# EAGLE design PWM_Input_Filter (EAGLE 7.3.0)
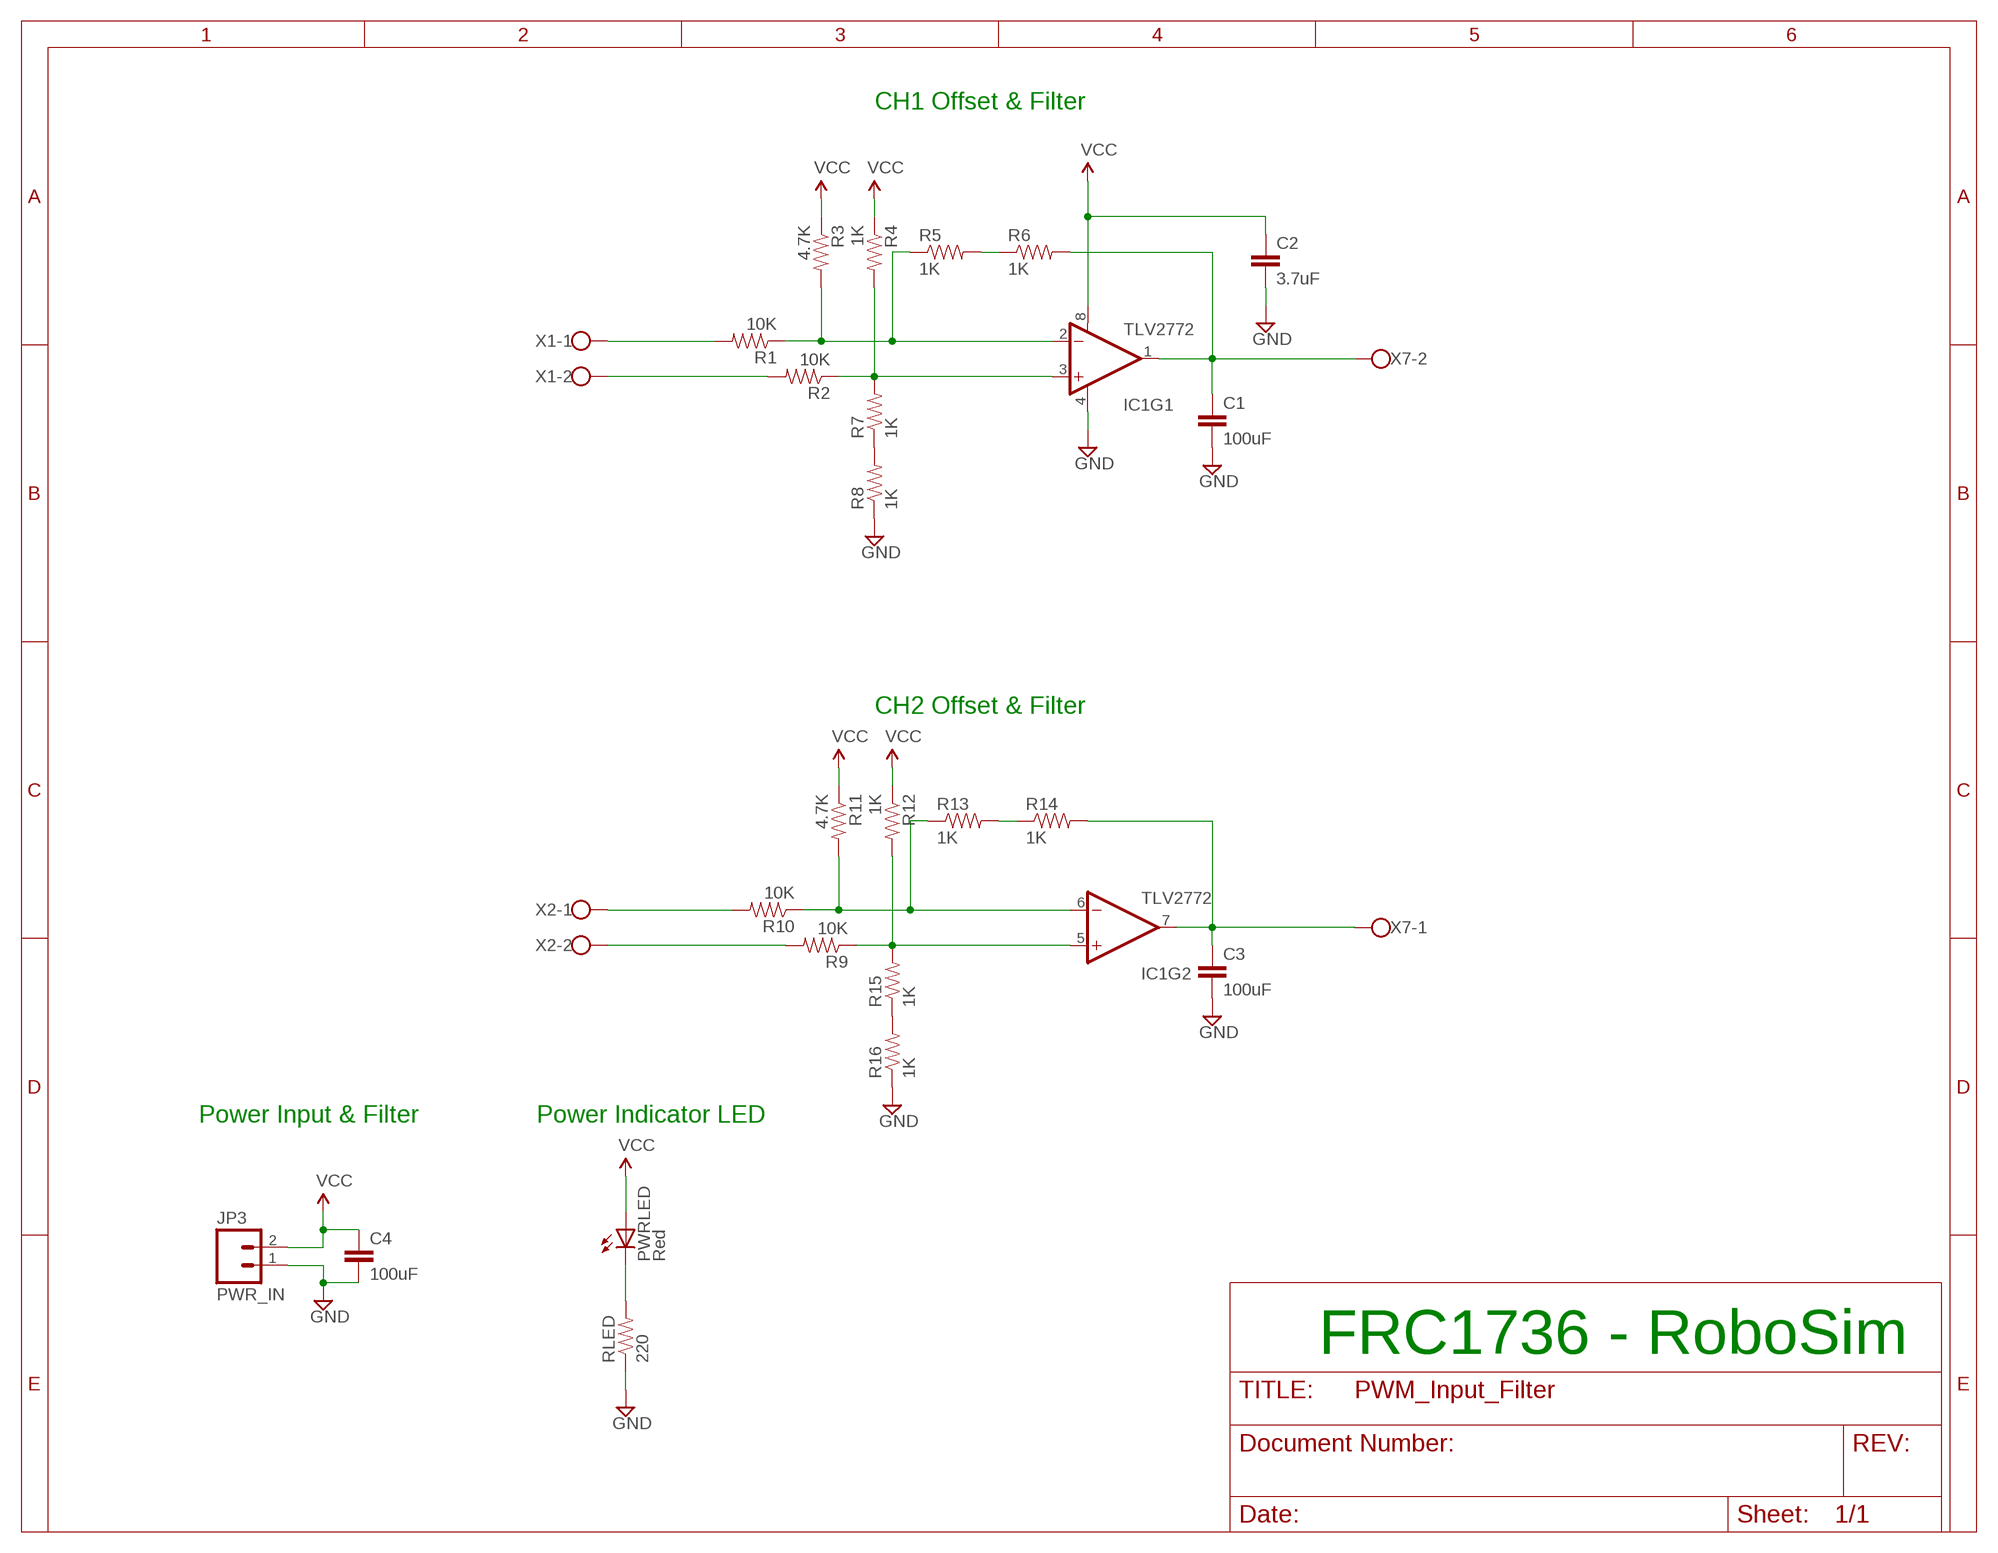
[diagram p0: schematic, sheet 1]

## Parts
C1  100uF  CAPPTH  [CAP-PTH-SMALL]
C2  3.7uF  CAPPTH  [CAP-PTH-SMALL]
C3  100uF  CAPPTH  [CAP-PTH-SMALL]
C4  100uF  CAPPTH  [CAP-PTH-SMALL]
IC1  TLV2772  LM358  [DIP08]
JP3  PWR_IN  M02LOCK  [1X02_LOCK]
PWRLED  Red  LED5MM  [LED5MM]
R1  10K  RESISTORAXIAL-0.3  [AXIAL-0.3]
R2  10K  RESISTORAXIAL-0.3  [AXIAL-0.3]
R3  4.7K  RESISTORAXIAL-0.3  [AXIAL-0.3]
R4  1K  RESISTORAXIAL-0.3  [AXIAL-0.3]
R5  1K  RESISTORAXIAL-0.3  [AXIAL-0.3]
R6  1K  RESISTORAXIAL-0.3  [AXIAL-0.3]
R7  1K  RESISTORAXIAL-0.3  [AXIAL-0.3]
R8  1K  RESISTORAXIAL-0.3  [AXIAL-0.3]
R9  10K  RESISTORAXIAL-0.3  [AXIAL-0.3]
R10  10K  RESISTORAXIAL-0.3  [AXIAL-0.3]
R11  4.7K  RESISTORAXIAL-0.3  [AXIAL-0.3]
R12  1K  RESISTORAXIAL-0.3  [AXIAL-0.3]
R13  1K  RESISTORAXIAL-0.3  [AXIAL-0.3]
R14  1K  RESISTORAXIAL-0.3  [AXIAL-0.3]
R15  1K  RESISTORAXIAL-0.3  [AXIAL-0.3]
R16  1K  RESISTORAXIAL-0.3  [AXIAL-0.3]
RLED  220  RESISTORAXIAL-0.3  [AXIAL-0.3]
X1  W237-102  [W237-102]
X2  W237-102  [W237-102]
X7  W237-102  [W237-102]

## Nets
GND: C1.2 C2.2 C3.2 C4.2 IC1.4(V-) JP3.1 R8.P$1 R16.P$1 RLED.P$1
N$1: R1.P$2 X1.1
N$3: R9.P$2 X2.2
N$5: PWRLED.K(C) RLED.P$2
N$6: IC1.2(-IN) R1.P$1 R3.P$2 R5.P$1
N$7: IC1.3(+IN) R2.P$1 R4.P$2 R7.P$2
N$8: R2.P$2 X1.2
N$9: R5.P$2 R6.P$1
N$10: R7.P$1 R8.P$2
N$11: IC1.6(-IN) R10.P$1 R11.P$2 R13.P$1
N$12: IC1.5(+IN) R9.P$1 R12.P$2 R15.P$2
N$13: C3.1 IC1.7(OUT) R14.P$2 X7.1
N$14: R10.P$2 X2.1
N$15: R13.P$2 R14.P$1
N$17: R15.P$1 R16.P$2
N$44: C1.1 IC1.1(OUT) R6.P$2 X7.2
VCC: C2.1 C4.1 IC1.8(V+) JP3.2 PWRLED.A R3.P$1 R4.P$1 R11.P$1 R12.P$1

## Notes on the sheet
- CH1 Offset & Filter
- CH2 Offset & Filter
- Power Input & Filter | Power Indicator LED
- FRC1736 - RoboSim

## Library data of the parts
C1-C4 = SparkFun-Passives:CAP: Capacitor Standard 0603 ceramic capacitor, and 0.1" leaded capacitor.
IC1 = SparkFun-AnalogIC:LM358: Jellybean op-amp; PROD_ID: IC-09172
JP3 = SparkFun-Connectors:M02: Standard 2-pin 0.1" header. Use with - straight break away headers ( PRT-00116) - right angle break away headers (PRT-00553) - swiss pins (PRT-00743) - machine pins (PRT-00117) - female headers (PRT-00115) Molex polarized connector foot print use with: PRT-08233 with associated crimp pins and housings. 2.54_SCREWTERM for use with PRT-10571. 3.5mm Screw Terminal footprints for PRT-08084 5mm Screw Terminal footprints for use with PRT-08433
PWRLED = SparkFun-LED:LED: LEDs Standard schematic elements and footprints for 5mm, 3mm, 1206, and 0603 sized LEDs. 5mm - Spark Fun Electronics SKU : COM-00529 (and others)
R1-R16 RLED = SparkFun-Passives:RESISTOR: Resistor Basic schematic elements and footprints for 0603, 1206, and PTH resistors.
X1 X2 X7 = con-wago-500:W237-102: WAGO SCREW CLAMP; MPN: 237-102; OC_FARNELL: unknown; OC_NEWARK: 70K9898

## Board
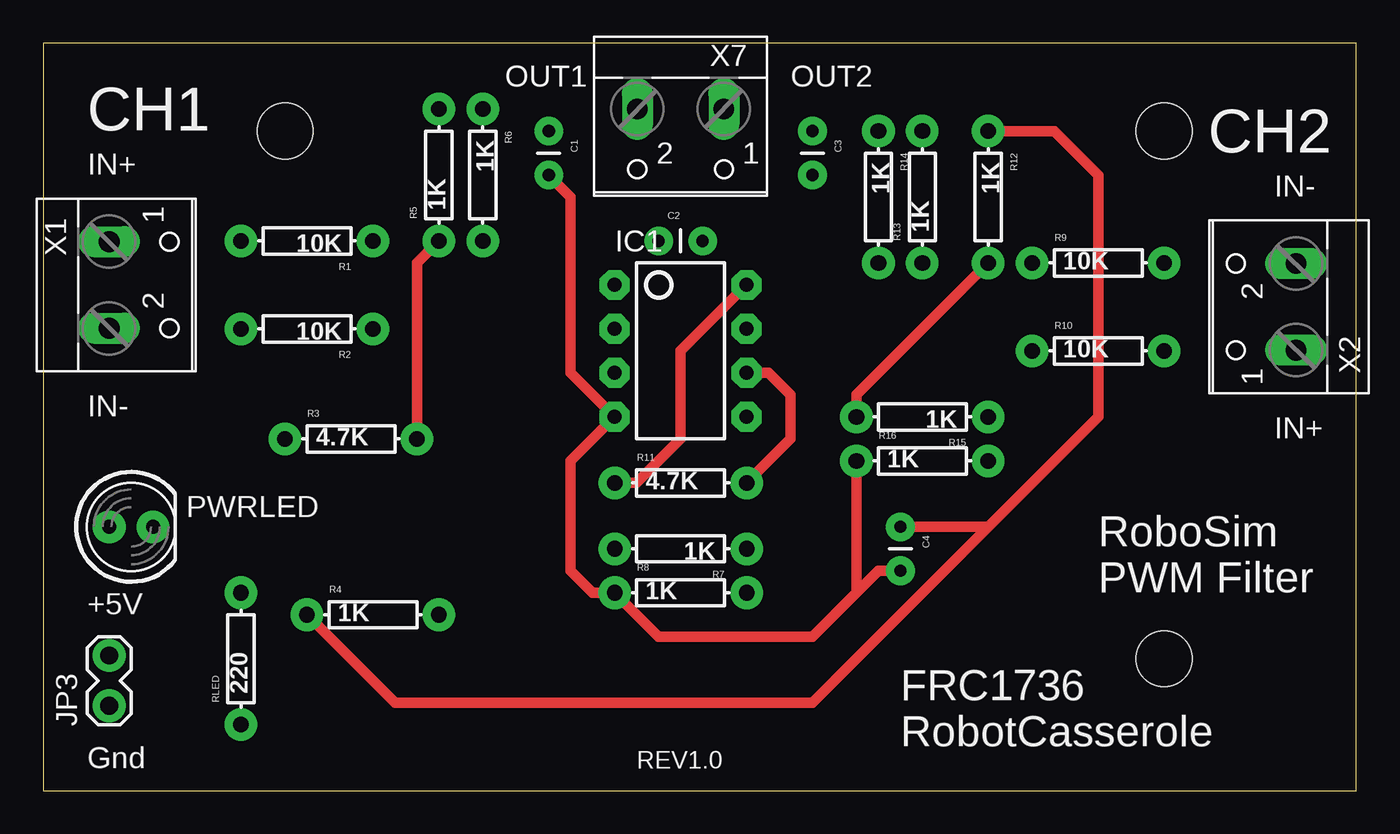
[diagram p1: board, top side]
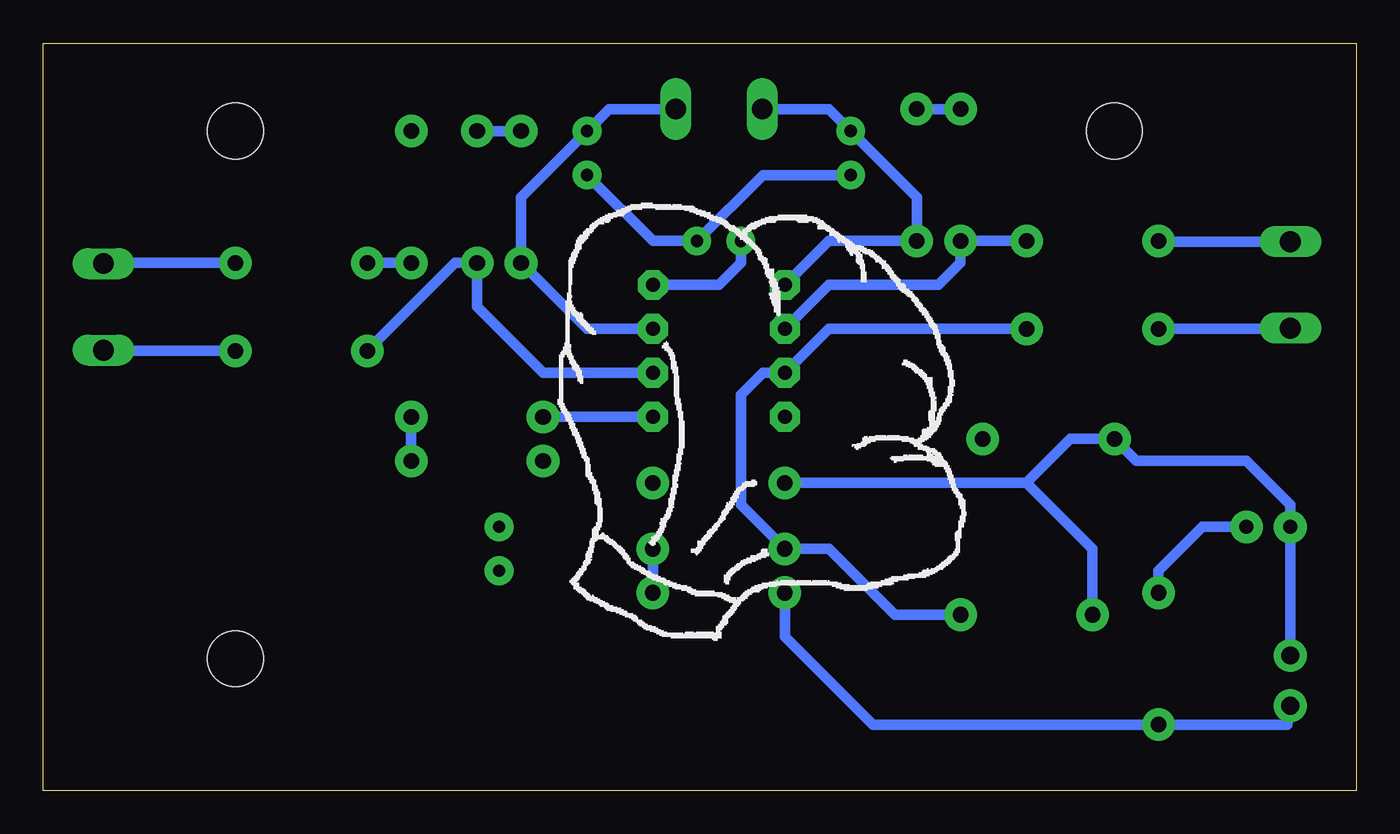
[diagram p2: board, bottom side, seen from below]

Size 75.87 x 43.17 mm. Coordinates in mm from the lower left corner, seen from the top.
Outline: 0,0 75.87,0 75.87,43.17 0,43.17 0,0
Copper layers (1*16): Top 0.0356mm / dielectric 1.5011mm / Bottom 0.0356mm
Design rules "LaenPCBOrder": minimum track width 6mil, minimum drill 13mil, track to track 6mil, track to pad 6mil, pad to pad 6mil, via to via 6mil, smd to smd 6mil, copper to edge 15mil, drill to drill 6mil, minimum pad ring 7mil, minimum via ring 7mil, stop-mask expansion 3mil, vias tented up to drill 0mil, thermal gap 10mil
Holes 3.2 mm at 13.97,38.1 64.77,38.1 64.77,7.62

### Footprints (pad centres in the part's own frame; a part is rotated, then mirrored left to right if it is on the bottom)
CAP-PTH-SMALL = drill 0.7 pad 1.651: 1 0,0; 2 2.54,0
DIP08 = drill 0.813 pad 1.727 octagon: 1 -3.81,-3.81; 2 -1.27,-3.81; 3 1.27,-3.81; 4 3.81,-3.81; 5 3.81,3.81; 6 1.27,3.81; 7 -1.27,3.81; 8 -3.81,3.81
1X02_LOCK = drill 1.016 pad 1.88: 1 -0.178,0; 2 2.718,0
LED5MM = drill 0.813 pad 1.88: A -1.27,0; K 1.27,0
AXIAL-0.3 = drill 0.9 pad 1.88: P$1 -3.81,0; P$2 3.81,0
W237-102 = drill 1.194 long: 1 -2.5,-1.27; 2 2.5,-1.27

### Placement (x,y rotation side)
C1  29.21,38.1 270 top
C2  35.56,31.75 0 top
C3  44.45,38.1 270 top
C4  49.53,15.24 270 top
IC1  36.83,25.4 270 top
JP3  3.81,5.08 90 top
PWRLED  5.08,15.24 0 top
R1  15.24,31.75 180 top
R2  15.24,26.67 180 top
R3  17.78,20.32 0 top
R4  19.05,10.16 0 top
R5  22.86,35.56 90 top
R6  25.4,35.56 270 top
R7  36.83,13.97 180 top
R8  36.83,11.43 0 top
R9  60.96,30.48 0 top
R10  60.96,25.4 0 top
R11  36.83,17.78 0 top
R12  54.61,34.29 270 top
R13  50.8,34.29 90 top
R14  48.26,34.29 270 top
R15  50.8,21.59 180 top
R16  50.8,19.05 0 top
RLED  11.43,7.62 90 top
X1  5.08,29.21 270 top
X2  71.12,27.94 90 top
X7  36.83,38.1 180 top

### Tracks (layer width: path | path; a pad name or v marks a point on that pad's centre or on a via)
GND
  Top 0.61: C1.2 30.48,34.29 30.48,24.13 IC1.4 30.48,19.05 30.48,12.7 31.75,11.43 R8.P$1 35.56,8.89 44.45,8.89 46.99,11.43 | R16.P$1 46.99,11.43 | C4.2 48.26,12.7 46.99,11.43
  Bottom 0.61: JP3.1 3.99,3.81 RLED.P$1 27.94,3.81 33.02,8.89 R8.P$1 | C1.2 34.29,35.56 C2.2 40.64,31.75 C3.2
N$1
  Bottom 0.61: X1.1 11.39,31.71 R1.P$2
N$3
  Bottom 0.61: R9.P$2 72.35,30.48 X2.2
N$5
  Bottom 0.61: RLED.P$2 11.43,12.7 8.89,15.24 PWRLED.K
N$6
  Top 0.61: R3.P$2 21.59,30.48 R5.P$1
  Bottom 0.61: IC1.2 30.48,29.21 24.13,29.21 22.86,30.48 R5.P$1 R1.P$1
N$7
  Bottom 0.61: R4.P$2 26.67,10.16 30.48,13.97 R7.P$2 35.56,16.51 35.56,22.86 34.29,24.13 IC1.3 30.48,26.67 R2.P$1
N$8
  Bottom 0.61: R2.P$2 3.85,26.67 X1.2
N$9
  Bottom 0.61: R5.P$2 R6.P$1
N$10
  Bottom 0.61: R8.P$2 R7.P$1
N$11
  Top 0.61: R11.P$2 43.18,20.32 43.18,22.86 41.91,24.13 IC1.6
  Bottom 0.61: R10.P$1 52.07,30.48 R13.P$1 50.8,27.94 46.99,24.13 IC1.6
N$12
  Top 0.61: R15.P$2 46.99,22.86 R12.P$2
  Bottom 0.61: R12.P$2 R9.P$1 | IC1.5 R15.P$2
N$13
  Bottom 0.61: X7.1 43.18,39.37 C3.1 48.26,34.29 R14.P$2 44.45,26.67 IC1.7
N$14
  Bottom 0.61: R10.P$2 72.35,25.4 X2.1
N$15
  Bottom 0.61: R14.P$1 R13.P$2
N$17
  Bottom 0.61: R16.P$2 R15.P$1
N$44
  Bottom 0.61: X7.2 30.48,39.37 C1.1 25.4,34.29 R6.P$2 30.48,31.75 IC1.1
VCC
  Top 0.61: R12.P$1 58.42,38.1 60.96,35.56 60.96,21.59 54.61,15.24 | 54.61,15.24 44.45,5.08 20.32,5.08 R4.P$1 | R11.P$1 34.29,17.78 36.83,20.32 36.83,25.4 IC1.8 | C4.1 54.61,15.24
  Bottom 0.61: JP3.2 PWRLED.A 3.81,16.51 6.35,19.05 12.7,19.05 R3.P$1 16.51,20.32 19.05,17.78 | C2.1 35.56,30.48 36.83,29.21 IC1.8 | 19.05,17.78 R11.P$1 | R4.P$1 15.24,13.97 19.05,17.78

### Text on the board
tNames: OUT1 | OUT2 | CH1 | CH2 | IN+ | IN- | IN- | IN+ | RoboSim / PWM Filter | +5V | FRC1736 / RobotCasserole | Gnd | REV1.0
200bmp: C:/RobotCasserole/RoboSim/Eagle/RoboSim/hat.bmp